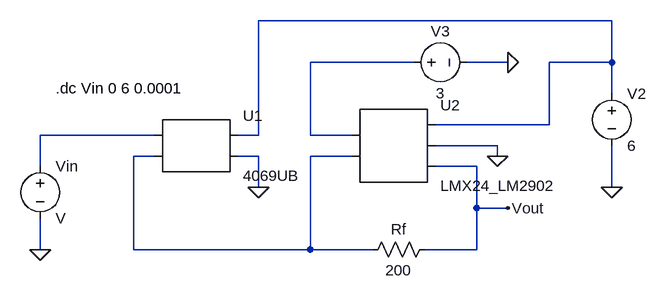
[diagram p0: schematic Q1.asc]
Q1.asc, the LTspice schematic file:
Version 4
SHEET 1 1380 680
WIRE 1168 96 624 96
WIRE 864 160 704 160
WIRE 1008 160 944 160
WIRE 1168 160 1168 96
WIRE 1168 160 1072 160
WIRE 1168 208 1168 160
WIRE 1072 256 1072 160
WIRE 1072 256 896 256
WIRE 464 272 288 272
WIRE 624 272 624 96
WIRE 624 272 592 272
WIRE 704 272 704 160
WIRE 768 272 704 272
WIRE 992 288 896 288
WIRE 464 304 432 304
WIRE 624 304 592 304
WIRE 768 304 704 304
WIRE 992 304 992 288
WIRE 288 320 288 272
WIRE 960 320 896 320
WIRE 624 352 624 304
WIRE 1168 352 1168 288
WIRE 960 384 960 320
WIRE 1008 384 960 384
WIRE 288 448 288 400
WIRE 432 448 432 304
WIRE 704 448 704 304
WIRE 704 448 432 448
WIRE 800 448 704 448
WIRE 960 448 960 384
WIRE 960 448 880 448
FLAG 624 352 0
FLAG 1168 352 0
FLAG 1008 160 0
FLAG 288 448 0
FLAG 992 304 0
FLAG 1008 384 Vout
SYMBOL AutoGenerated/4069UB 528 288 R0
SYMATTR InstName U1
SYMBOL AutoGenerated/LMX24_LM2902 832 288 R0
SYMATTR InstName U2
SYMBOL res 896 432 R90
WINDOW 0 0 56 VBottom 2
WINDOW 3 32 56 VTop 2
SYMATTR InstName Rf
SYMATTR Value 200
SYMBOL voltage 288 304 R0
SYMATTR InstName Vin
SYMBOL voltage 1168 192 R0
SYMATTR InstName V2
SYMATTR Value 6
SYMBOL voltage 848 160 R270
WINDOW 0 32 56 VTop 2
WINDOW 3 -32 56 VBottom 2
SYMATTR InstName V3
SYMATTR Value 3
TEXT 312 200 Left 2 !.dc Vin 0 6 0.0001

The netlist it stands for:
* Q1.asc
* U1: 4069UB (symbol AutoGenerated/4069UB not available, pins judged from their places): pin1=N003 pin2=N004 pin3=N001 pin4=0
* U2: LMX24_LM2902 (symbol AutoGenerated/LMX24_LM2902 not available, pins judged from their places): pin1=N002 pin2=N004 pin3=N001 pin4=0 pin5=Vout
Rf Vout N004 200
Vin N003 0 V
V2 N001 0 6
V3 N002 0 3
.dc Vin 0 6 0.0001
.backanno
.end